# Altium schematic sheet Connector.SchDoc
size A4; SheetNumber: 1; SheetTotal: 4
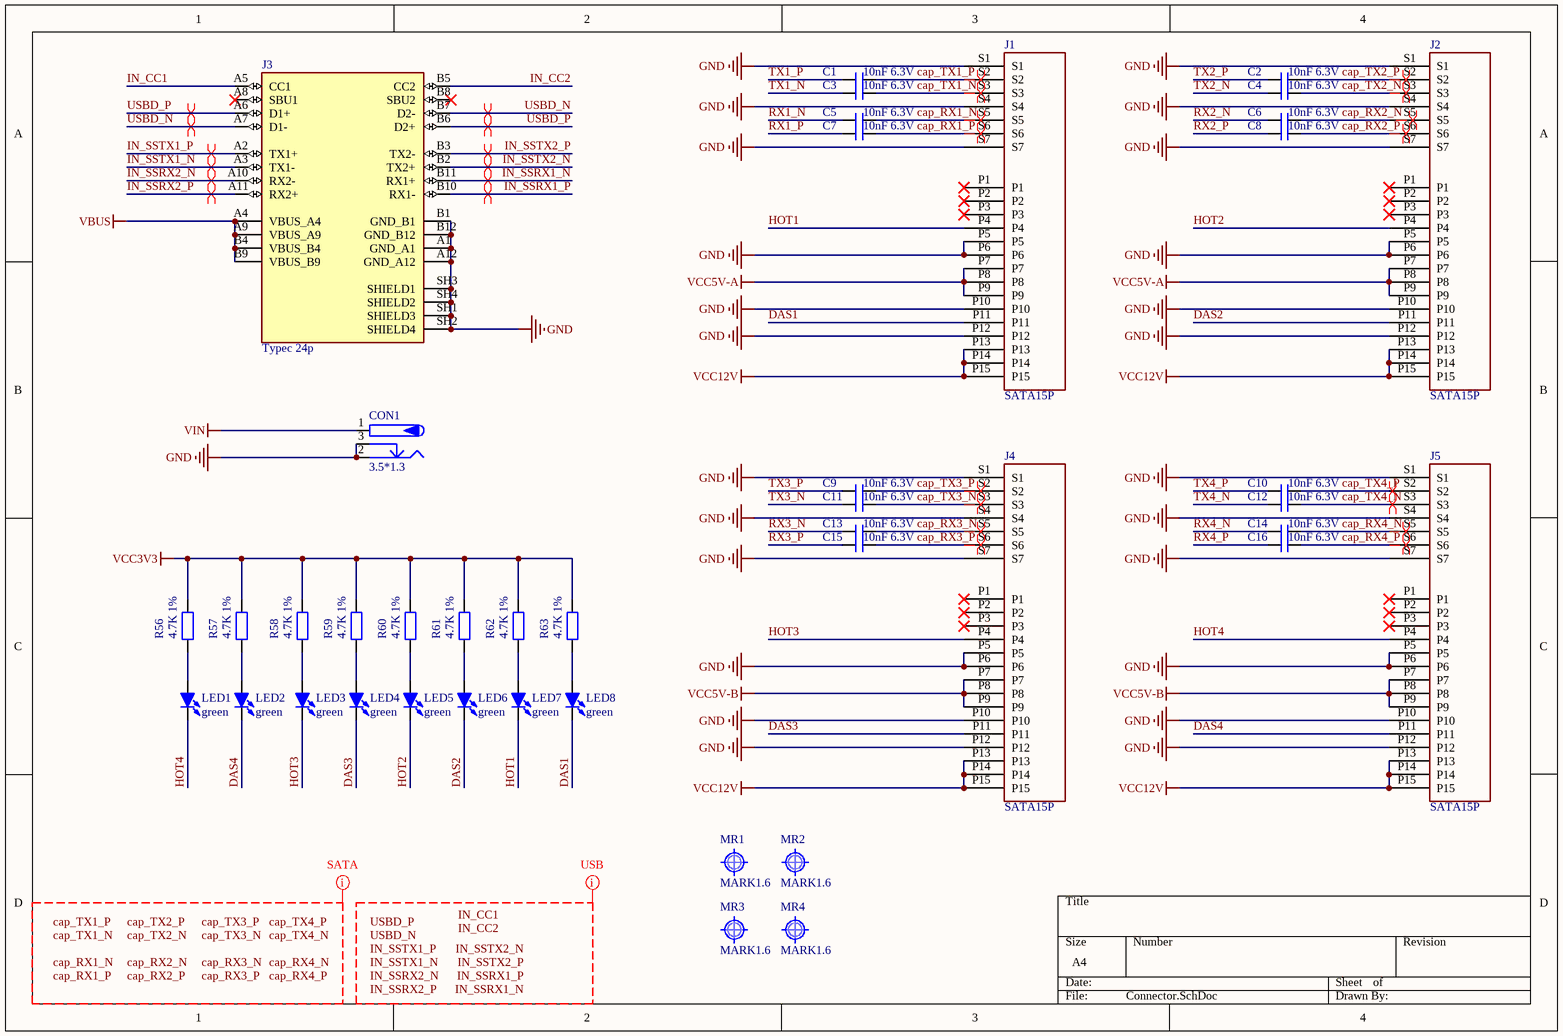
[diagram p0: Connector.SchDoc]

## Parts
C1  10nF 6.3V  [C0402_L]
C2  10nF 6.3V  [C0402_L]
C3  10nF 6.3V  [C0402_L]
C4  10nF 6.3V  [C0402_L]
C5  10nF 6.3V  [C0402_L]
C6  10nF 6.3V  [C0402_L]
C7  10nF 6.3V  [C0402_L]
C8  10nF 6.3V  [C0402_L]
C9  10nF 6.3V  [C0402_L]
C10  10nF 6.3V  [C0402_L]
C11  10nF 6.3V  [C0402_L]
C12  10nF 6.3V  [C0402_L]
C13  10nF 6.3V  [C0402_L]
C14  10nF 6.3V  [C0402_L]
C15  10nF 6.3V  [C0402_L]
C16  10nF 6.3V  [C0402_L]
CON1  3.5*1.3  [DC-012]
J1  SATA15P  [SATA 15P 贴片]
J2  SATA15P  [SATA 15P 贴片]
J3  Typec 24p  [TypeC 24p 直立]
J4  SATA15P  [SATA 15P 贴片]
J5  SATA15P  [SATA 15P 贴片]
LED1  green  [LED 0805G]
LED2  green  [LED0805_W]
LED3  green  [LED 0805G]
LED4  green  [LED0805_W]
LED5  green  [LED 0805G]
LED6  green  [LED0805_W]
LED7  green  [LED 0805G]
LED8  green  [LED0805_W]
MR1  MARK1.6  [Mark 1]
MR2  MARK1.6  [Mark 1]
MR3  MARK1.6  [Mark 1]
MR4  MARK1.6  [Mark 1]
R56  4.7K 1%  [R0402_L]
R57  4.7K 1%  [R0402_L]
R58  4.7K 1%  [R0402_L]
R59  4.7K 1%  [R0402_L]
R60  4.7K 1%  [R0402_L]
R61  4.7K 1%  [R0402_L]
R62  4.7K 1%  [R0402_L]
R63  4.7K 1%  [R0402_L]

## Nets
GND: CON1.2 CON1.3 J1.P5 J1.P6 J1.P10 J1.P12 J1.S1 J1.S4 J1.S7 J2.P5 J2.P6 J2.P10 J2.P12 J2.S1 J2.S4 J2.S7 J3.A1(GND_A1) J3.A12(GND_A12) J3.B1(GND_B1) J3.B12(GND_B12) J3.SH1(SHIELD3) J3.SH2(SHIELD4) J3.SH3(SHIELD1) J3.SH4(SHIELD2) J4.P5 J4.P6 J4.P10 J4.P12 J4.S1 J4.S4 J4.S7 J5.P5 J5.P6 J5.P10 J5.P12 J5.S1 J5.S4 J5.S7
VBUS: J3.A4(VBUS_A4) J3.A9(VBUS_A9) J3.B4(VBUS_B4) J3.B9(VBUS_B9)
VCC3V3: R56.1 R57.1 R58.1 R59.1 R60.1 R61.1 R62.1 R63.1
VCC5V-A: J1.P7 J1.P8 J1.P9 J2.P7 J2.P8 J2.P9
VCC5V-B: J4.P7 J4.P8 J4.P9 J5.P7 J5.P8 J5.P9
VCC12V: J1.P13 J1.P14 J1.P15 J2.P13 J2.P14 J2.P15 J4.P13 J4.P14 J4.P15 J5.P13 J5.P14 J5.P15
VIN: CON1.1
cap_RX1_N: C5.1 J1.S5
cap_RX1_P: C7.1 J1.S6
cap_RX2_N: C6.1 J2.S5
cap_RX2_P: C8.1 J2.S6
cap_RX3_N: C13.1 J4.S5
cap_RX3_P: C15.1 J4.S6
cap_RX4_N: C14.1 J5.S5
cap_RX4_P: C16.1 J5.S6
cap_TX1_N: C3.1 J1.S3
cap_TX1_P: C1.1 J1.S2
cap_TX2_N: C4.1 J2.S3
cap_TX2_P: C2.1 J2.S2
cap_TX3_N: C11.1 J4.S3
cap_TX3_P: C9.1 J4.S2
cap_TX4_N: C12.1 J5.S3
cap_TX4_P: C10.1 J5.S2
DAS1: J1.P11 LED8.2(K)
DAS2: J2.P11 LED6.2(K)
DAS3: J4.P11 LED4.2(K)
DAS4: J5.P11 LED2.2(K)
HOT1: J1.P4 LED7.2(K)
HOT2: J2.P4 LED5.2(K)
HOT3: J4.P4 LED3.2(K)
HOT4: J5.P4 LED1.2(K)
IN_CC1: J3.A5(CC1)
IN_CC2: J3.B5(CC2)
IN_SSRX1_N: J3.B11(RX1+)
IN_SSRX1_P: J3.B10(RX1-)
IN_SSRX2_N: J3.A10(RX2-)
IN_SSRX2_P: J3.A11(RX2+)
IN_SSTX1_N: J3.A3(TX1-)
IN_SSTX1_P: J3.A2(TX1+)
IN_SSTX2_N: J3.B2(TX2+)
IN_SSTX2_P: J3.B3(TX2-)
RX1_N: C5.2
RX1_P: C7.2
RX2_N: C6.2
RX2_P: C8.2
RX3_N: C13.2
RX3_P: C15.2
RX4_N: C14.2
RX4_P: C16.2
TX1_N: C3.2
TX1_P: C1.2
TX2_N: C4.2
TX2_P: C2.2
TX3_N: C11.2
TX3_P: C9.2
TX4_N: C12.2
TX4_P: C10.2
USBD_N: J3.A7(D1-) J3.B7(D2-)
USBD_P: J3.A6(D1+) J3.B6(D2+)
NetLED1_1: LED1.1(A) R56.2
NetLED2_1: LED2.1(A) R57.2
NetLED3_1: LED3.1(A) R58.2
NetLED4_1: LED4.1(A) R59.2
NetLED5_1: LED5.1(A) R60.2
NetLED6_1: LED6.1(A) R61.2
NetLED7_1: LED7.1(A) R62.2
NetLED8_1: LED8.1(A) R63.2

Not connected (* = marked no-connect by the designer): J1 P1* P2* P3*; J2 P1* P2* P3*; J3 A8(SBU1)* B8(SBU2)*; J4 P1* P2* P3*; J5 P1* P2* P3*

## Layout directives
net class SATA; rule Differential Pairs Routing [Pref Gap = 6mil    Min Gap  = 6mil    Max Gap  = 6milPref Width = 4.29mil    Min Width  = 4.29mil    Max Width  = 4.29mil]: cap_RX1_N, cap_RX1_P, cap_RX2_N, cap_RX2_P, cap_RX3_N, cap_RX3_P, cap_RX4_N, cap_RX4_P, cap_TX1_N, cap_TX1_P, cap_TX2_N, cap_TX2_P, cap_TX3_N, cap_TX3_P, cap_TX4_N, cap_TX4_P
differential pair: (no net found under the mark), cap_RX1_N, cap_RX1_P, cap_RX2_P, cap_RX3_N, cap_RX3_P, cap_RX4_N, cap_RX4_P, cap_TX1_N, cap_TX1_P, cap_TX2_N, cap_TX2_P, cap_TX3_N, cap_TX3_P, cap_TX4_N, cap_TX4_P, IN_SSRX1_N, IN_SSRX1_P, IN_SSRX2_N, IN_SSRX2_P, IN_SSTX1_N, IN_SSTX1_P, IN_SSTX2_N, IN_SSTX2_P, USBD_N, USBD_P
net class USB; rule Differential Pairs Routing [Pref Gap = 4mil    Min Gap  = 4mil    Max Gap  = 4milPref Width = 5.15mil    Min Width  = 5.15mil    Max Width  = 5.15mil]: IN_CC1, IN_CC2, IN_SSRX1_N, IN_SSRX1_P, IN_SSRX2_N, IN_SSRX2_P, IN_SSTX1_N, IN_SSTX1_P, IN_SSTX2_N, IN_SSTX2_P, USBD_N, USBD_P

## Notes on the sheet
- Labels drawn without touching a wire or pin: cap_RX1_N, cap_RX1_P, cap_RX2_N, cap_RX2_P, cap_RX3_N, cap_RX3_P, cap_RX4_N, cap_RX4_P, cap_TX1_N, cap_TX1_P, cap_TX2_N, cap_TX2_P, cap_TX3_N, cap_TX3_P, cap_TX4_N, cap_TX4_P, IN_CC1, IN_CC2, IN_SSRX1_N, IN_SSRX1_P, IN_SSRX2_N, IN_SSRX2_P, IN_SSTX1_N, IN_SSTX1_P, IN_SSTX2_N, IN_SSTX2_P, USBD_N, USBD_P

## Library data of the parts
C1-C16 = C: 无极性贴片电容; 版权归属: 源创客; 材质: X7R; BOM名称: 无极性贴片电容; 学习资源: www.ooocke.com
CON1 = P-DC: 低压电源接口; BOM名称: DC电源接口; 版权归属: 源创客; 学习资源: www.ooocke.com
J3 = Typec 24p: USB-C (USB TYPE-C) USB 3.2 Gen 2 (USB 3.1 Gen 2, Superspeed + (USB 3.1)) Receptacle Connector 24 Position Surface Mount, Right Angle; Through Hole; MF: Molex; MP: 1054500101; SnapEDA_Link: https://www.snapeda.com/parts/1054500101/Molex/view-part/?ref=snap; Package: None; Value: *; Check_prices: https://www.snapeda.com/parts/1054500101/Molex/view-part/?ref=eda
LED1-LED8 = LED-3MM: 插件LED; 版权归属: 源创客; BOM名称: 插件LED; 学习资源: www.ooocke.com
MR1-MR4 = MARK: 光学定位点; 版权归属: 源创客; BOM名称: 光学定位点; 学习资源: www.ooocke.com
R56-R63 = R: 贴片电阻; 版权归属: 源创客; BOM名称: 贴片电阻; 学习资源: www.ooocke.com